# Altium schematic sheet Ejercicio3.SchDoc
size A4
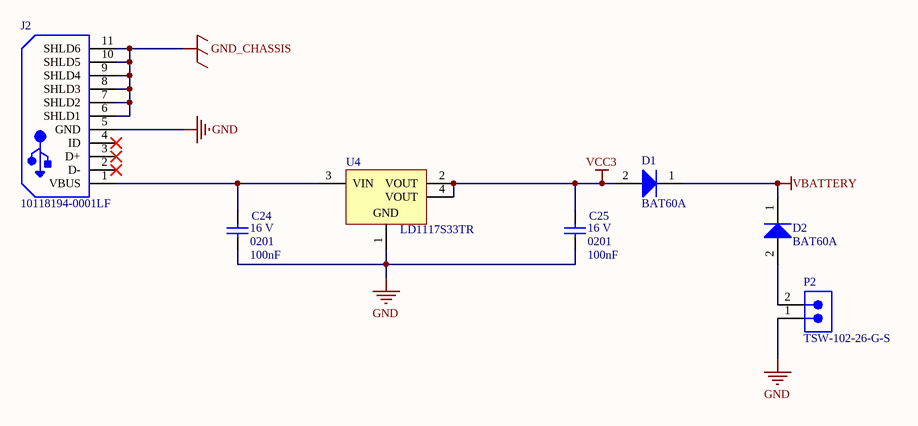
[diagram p0: Ejercicio3.SchDoc]

## Parts
C24  value 100nF  Rated Voltage: 16 V  Case-EIA: 0201  [CAPC0201(0603)33_N]  (hidden comment: CAP 100nF 16V 0201(0603))
C25  value 100nF  Rated Voltage: 16 V  Case-EIA: 0201  [CAPC0201(0603)33_N]  (hidden comment: CAP 100nF 16V 0201(0603))
D1  BAT60A  [INF-SOD323_V]
D2  BAT60A  [INF-SOD323_V]
J2  10118194-0001LF  [FCI-10118194-0001LF-5_V]
P2  TSW-102-26-G-S  [SMTC-TSW-102-26-XX-S]
U4  LD1117S33TR  [SOT-223_L]

## Nets
GND: C24.2 C25.2 J2.5(GND) P2.1 U4.1(GND)
GND_CHASSIS: J2.6(SHLD1) J2.7(SHLD2) J2.8(SHLD3) J2.9(SHLD4) J2.10(SHLD5) J2.11(SHLD6)
VBATTERY: D1.1(K) D2.1(K)
VCC3: C25.1 D1.2(A) U4.2(VOUT) U4.4(VOUT)
NetC24_1: C24.1 J2.1(VBUS) U4.3(VIN)
NetD2_2: D2.2(A) P2.2

Not connected (* = marked no-connect by the designer): J2 2(D-)* 3(D+)* 4(ID)*

## Library data of the parts
C24 C25 = CMP-1033-00663-1: CAP 100nF 16V ±10% 0201 (0603 Metric) Thickness 0.33mm SMD; Case-Metric: 0603; Tolerance: Â±10%; Max Thickness: 0.33 mm; Technology: SMT
D1 D2 = CMP-1183-00008-2: Silicon Schottky Diode, -55 to 85 degC, SOD323, Reel, Green; Manufacturer: Infineon; Green: TRUE; VR (max): 10Â V; IF (max): 3,000Â mA; VF (max): 370Â mV; CT (max): 35Â pF; Configuration: Single; PackageDescription: 3-Pin Small Outline Transistor Package, 1.25 x 2 mm Body, 0.65 mm Pitch; PartNumber: BAT60A; Mounting Technology: Surface Mount; PackageReference: SOT323; ComponentLink1Description: Manufacturer URL; Packing: Reel; ComponentLink3URL: http://www.infineon.com/dgdl/SOT323-Package_Overview.pdf?folderId=db3a30431936bc4b0119533e1dcb3c92&fileId=db3a30431936bc4b011953495f283cb1; ComponentLink2URL: http://www.infineon.com/dgdl/bat60aseries.pdf?folderId=db3a304313d846880113def5812204a1&fileId=db3a304313d846880113def70c9304a9; ComponentLink1URL: http://www.infineon.com/; ComponentLink2Description: Datasheet; ComponentLink3Description: Package Specification
J2 = CMP-2000-05120-1: Micro USB B Type Receptacle, 1.8 A, -55 to 85 degC, 5-Pin SMD, RoHS, Tape and Reel; Manufacturer: Amphenol FCI; Body Orientation: RightAngle; Number of Contacts: 5; Pitch: 0.65mm; Gender: RCP; Rad Hard: No; Package Reference: 10118194-0001LF-5; Mounting: SurfaceMount; Manufacturer URL: http://www.fci.com/; Packaging: CutTape; Datasheet URL: https://datasheet.ciiva.com/26945/getdatasheetpartid-418619-26945695.pdf; Termination Method: Solder; Package Description: 5-Pin Surface Mount Device, Body 8.05 x 5.53 mm, Pitch 0.65 mm; Type: MicroUSBTypeB; Datasheet Version: Rev. A, 10/2011
P2 = CMP-1024-00327-1: 0.025" SQ Post Header, Through-hole, Vertical, -55 to 125 degC, 2.54 mm Pitch, 2-Pin, Male, RoHS; Manufacturer: Samtec; Pitch: 2.54 mm; Orientation: Vertical; ComponentLink3Description: Package Specification; PackageReference: TSW-102-26-XX-S; Mounting Technology: Through-hole; ComponentLink2Description: Datasheet; ComponentLink1URL: http://www.samtec.com; DatasheetVersion: F-214; ComponentLink1Description: Manufacturer URL; RoHS: True; ComponentLink2URL: http://www.samtec.com/documents/webfiles/pdf/TSW_TH.PDF; PartNumber: TSW-102-26-G-S; ComponentLink3URL: http://www.samtec.com/documents/webfiles/cpdf/TSW-XXX-XX-XXX-X-XX-XXX-MKT.pdf; PackageDescription: .025[0.64] SQ. Post Terminal Strip Assembly; PackageVersion: DM, 8/1988; Temperature Range: -55 to 125 degC
U4 = CMP-0244-00310-1: Fixed Low Drop Positive Voltage Regulator, 3.3V, 4-Pin SOT-223, Tape and Reel; ComponentLink2Description: Datasheet; PackageDescription: 4-Pin SOT-223 Package, 6.5 x 3.5 mm Body, 2.3 mm Pitch, 7 mm Lead Span; PackageVersion: 2010; ComponentLink2URL: http://www.st.com/internet/com/TECHNICAL_RESOURCES/TECHNICAL_LITERATURE/DATASHEET/CD00000544.pdf; PackageReference: SOT-223; DatasheetVersion: 1/11/2011; ComponentLink1Description: Manufacturer URL; ComponentLink1URL: http://www.st.com